# Altium schematic sheet Smart_Clock_Mainboard.SchDoc
size A2
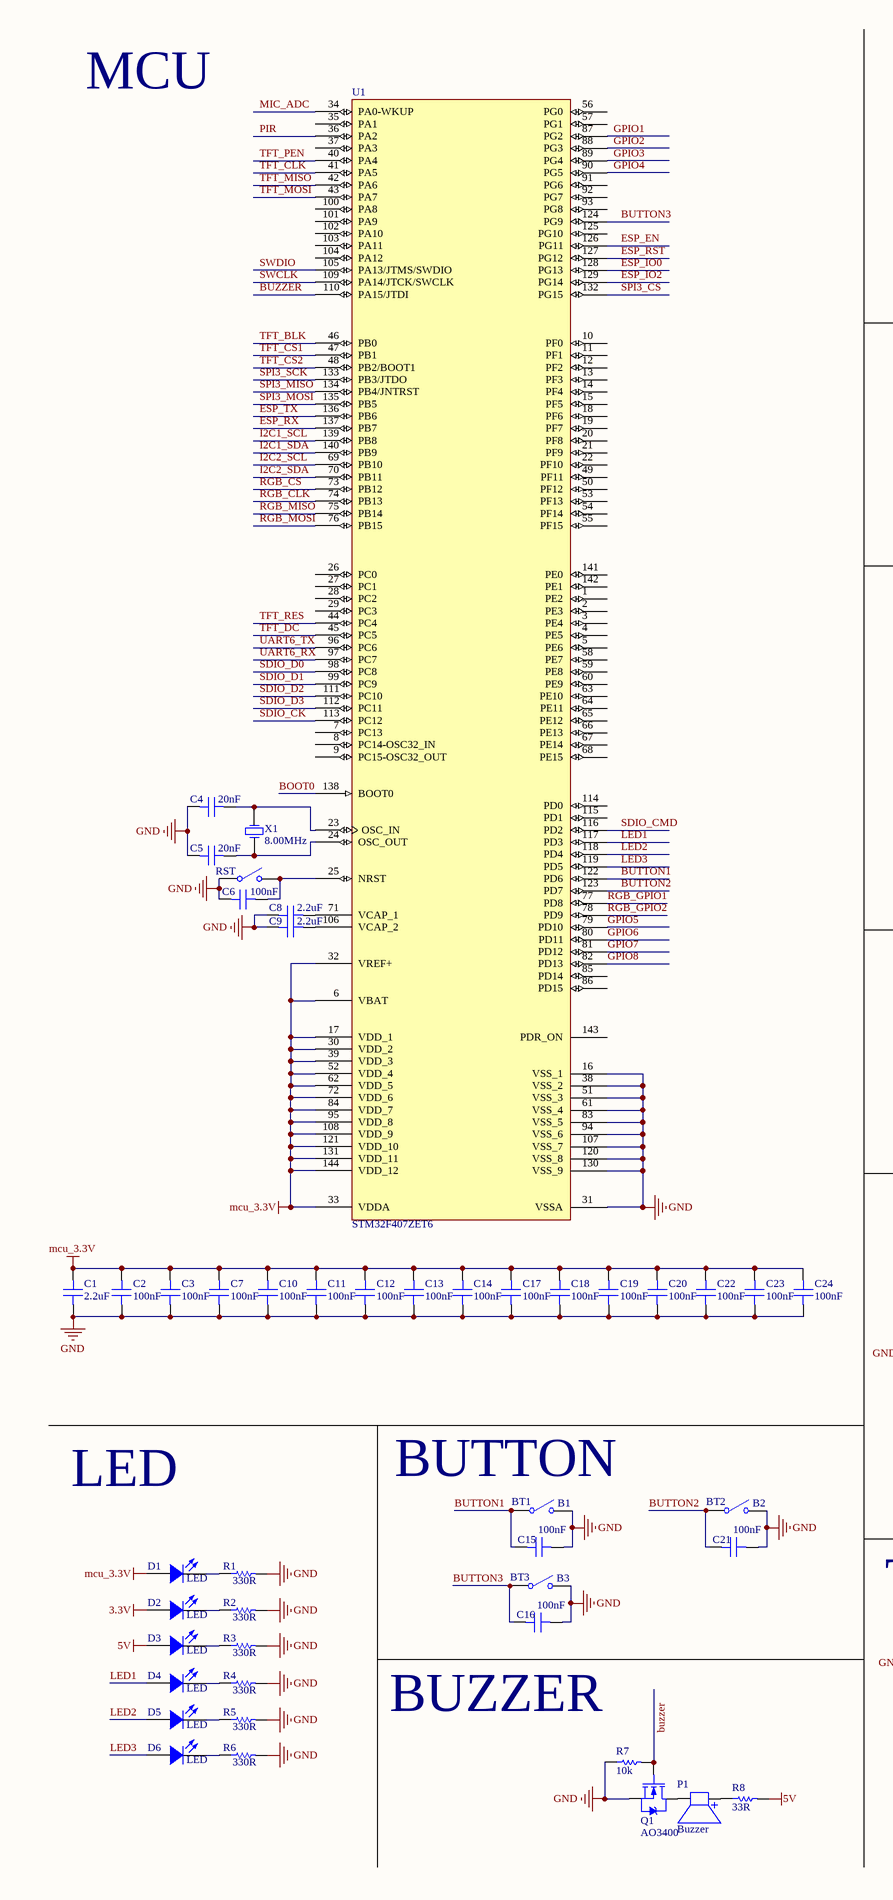
[diagram p0: Smart_Clock_Mainboard.SchDoc, left]
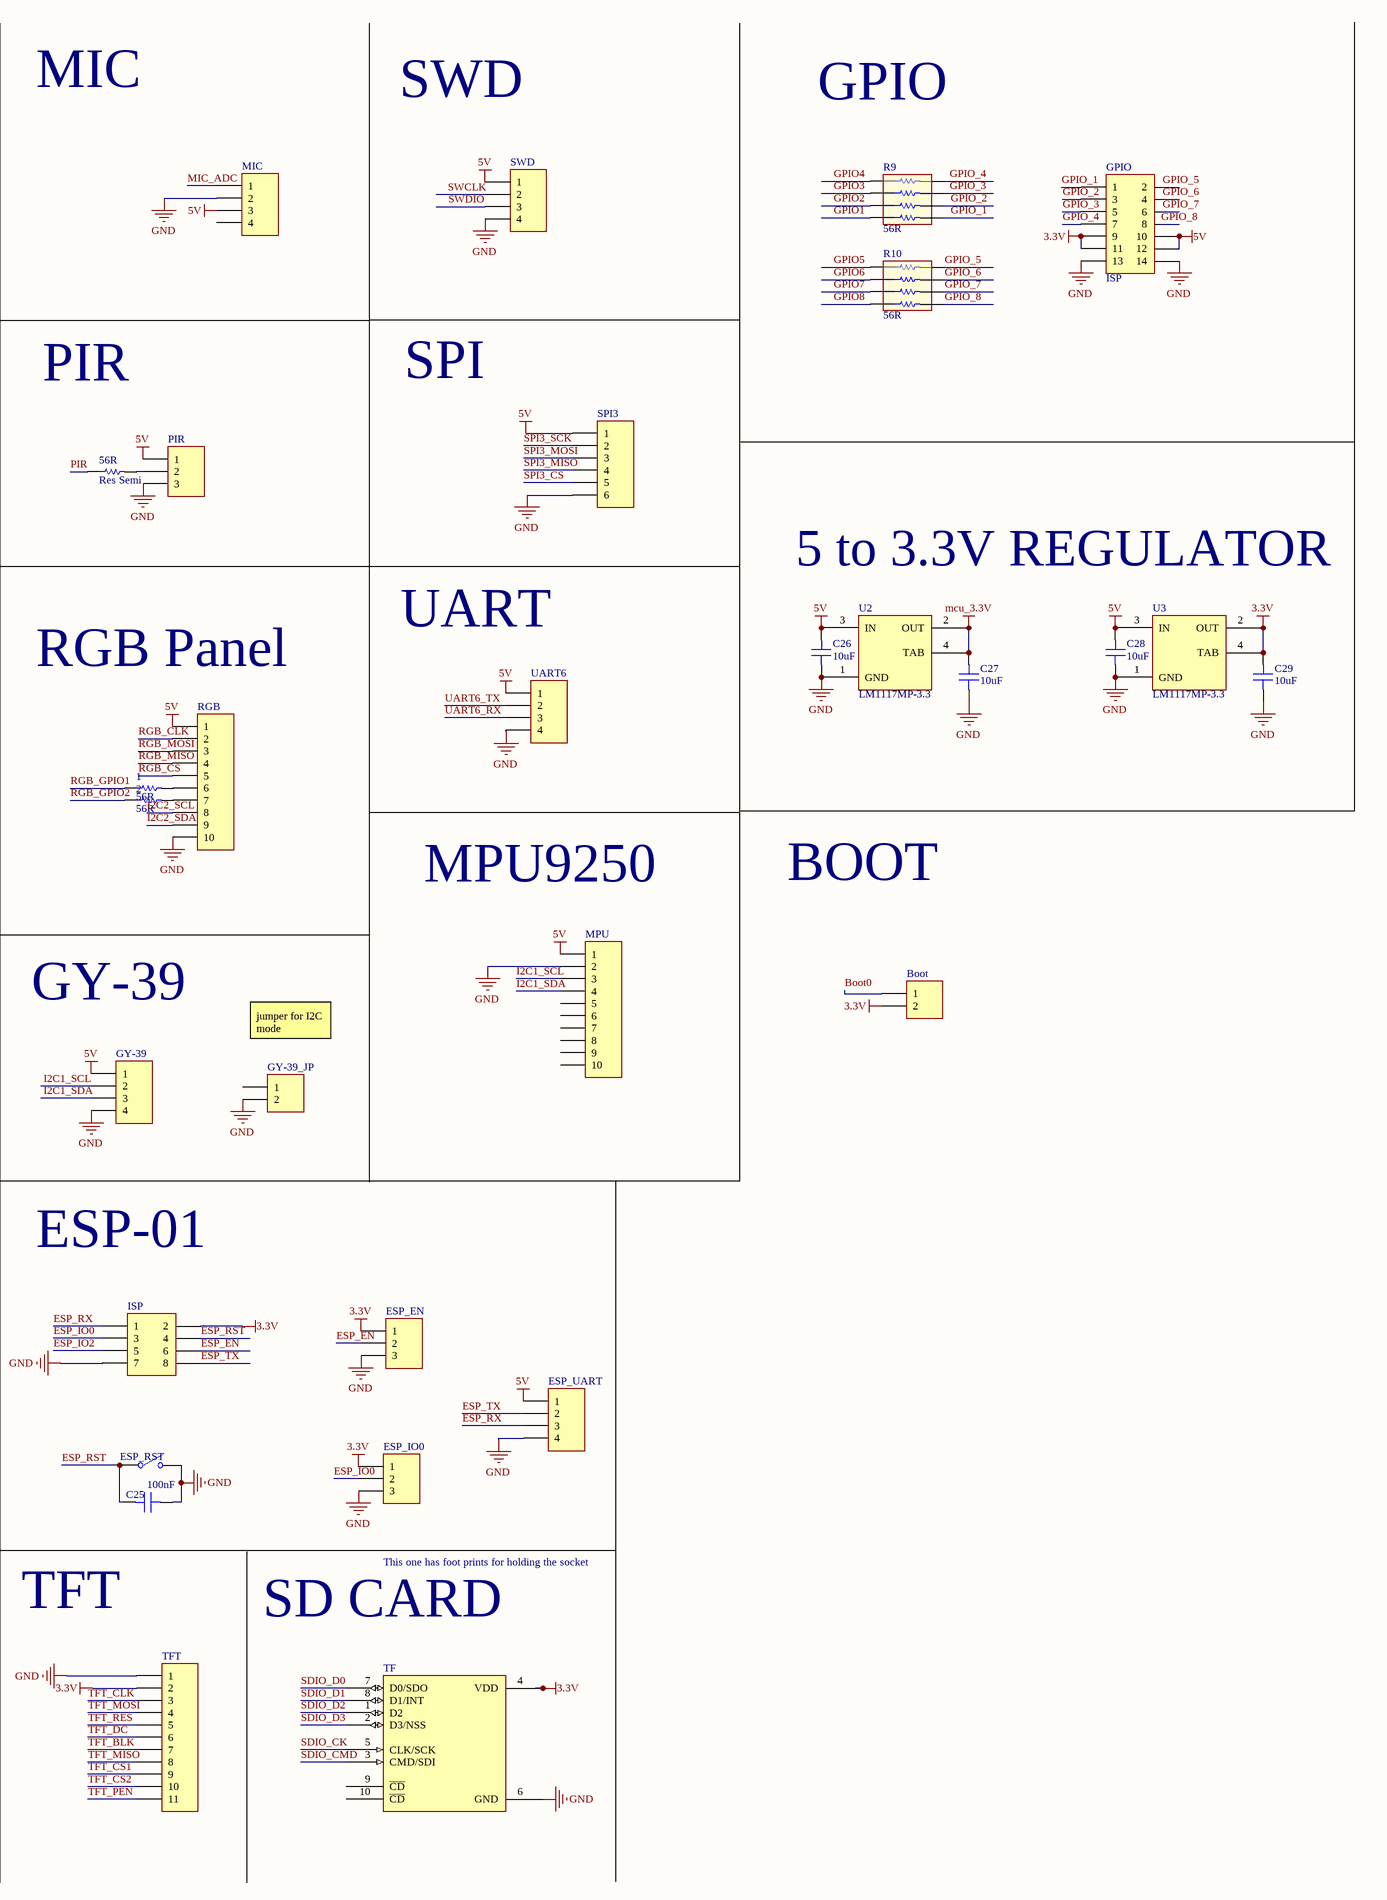
[diagram p1: Smart_Clock_Mainboard.SchDoc, right]

## Parts
1  56R  [CR2012-0805]
2  56R  [CR2012-0805]
56R  Res Semi  [CR2012-0805]
Boot  Boot  [HDR1X2]  (value not drawn)
BT1  B1  [PUSH SWITCH 2-PIN]
BT2  B2  [PUSH SWITCH 2-PIN]
BT3  B3  [PUSH SWITCH 2-PIN]
C1  2.2uF  [CC2012-0805]
C2  100nF  [CC2012-0805]
C3  100nF  [CC2012-0805]
C4  20nF  [CC2012-0805]
C5  20nF  [CC2012-0805]
C6  100nF  [CC2012-0805]
C7  100nF  [CC2012-0805]
C8  2.2uF  [CC2012-0805]
C9  2.2uF  [CC2012-0805]
C10  100nF  [CC2012-0805]
C11  100nF  [CC2012-0805]
C12  100nF  [CC2012-0805]
C13  100nF  [CC2012-0805]
C14  100nF  [CC2012-0805]
C15  100nF  [CC2012-0805]
C16  100nF  [CC2012-0805]
C17  100nF  [CC2012-0805]
C18  100nF  [CC2012-0805]
C19  100nF  [CC2012-0805]
C20  100nF  [CC2012-0805]
C21  100nF  [CC2012-0805]
C22  100nF  [CC2012-0805]
C23  100nF  [CC2012-0805]
C24  100nF  [CC2012-0805]
C25  100nF  [CC2012-0805]
C26  10uF  [CC2012-0805]
C27  10uF  [CC2012-0805]
C28  10uF  [CC2012-0805]
C29  10uF  [CC2012-0805]
D1  LED  [D0805]
D2  LED  [D0805]
D3  LED  [D0805]
D4  LED  [D0805]
D5  LED  [D0805]
D6  LED  [D0805]
ESP_EN  ESP_EN  [HDR1X3]  (value not drawn)
ESP_IO0  ESP_IO0  [HDR1X3]  (value not drawn)
ESP_RST  ESP_RST  [PUSH SWITCH 2-PIN]  (value not drawn)
ESP_UART  ESP_UART  [LOCKEDHDR-4W]  (value not drawn)
GPIO  ISP  [HDR2X7]
GY-39  CONN0M  [HDR1X4]  (value not drawn)
GY-39_JP  MOTOR  [HDR1X2]  (value not drawn)
ISP  ISP  [HDR1.27_2x4]  (value not drawn)
MIC  Header 4  [HDR1X4]  (value not drawn)
MPU  Header10  [HDR1X10]  (value not drawn)
P1  Buzzer  [BUZ-9.0]
PIR  PIR  [HDR1X3]  (value not drawn)
Q1  AO3400  [SO-G3/Z3.3]
R1  330R  [CR2012-0805]
R2  330R  [CR2012-0805]
R3  330R  [CR2012-0805]
R4  330R  [CR2012-0805]
R5  330R  [CR2012-0805]
R6  330R  [CR2012-0805]
R7  10k  [CR2012-0805]
R8  33R  [CR2012-0805]
R9  56R  [ARC241-0603x4]
R10  56R  [ARC241-0603x4]
RGB  Header 10  [HDR1X10]  (value not drawn)
RST  RESET  [PUSH SWITCH 2-PIN]  (value not drawn)
SPI3  SPI3  [HDR1X6]  (value not drawn)
SWD  Header 4  [LOCKEDHDR-4W]  (value not drawn)
TF  TF CD Socket  [SD-502774-0811]  (value not drawn)
TFT  TFT  [HDR1X11]  (value not drawn)
U1  STM32F407ZET6  [LQFP144_M]
U2  LM1117MP-3.3  [MP04A_N]
U3  LM1117MP-3.3  [MP04A_N]
UART6  UART6  [LOCKEDHDR-4W]  (value not drawn)
X1  8.00MHz  [BCY-W2/E4.7]

## Nets
3.3V: Boot.2 C29.2 D2.1(A) ESP_EN.1 ESP_IO0.1 GPIO.9 GPIO.11 ISP.2 TF.4(VDD) TFT.2 U3.2(OUT) U3.4(TAB)
5V: C26.2 C28.2 D3.1(A) ESP_UART.1 GPIO.10 GPIO.12 GY-39.1 MIC.3 MPU.1 PIR.1 R8.2 RGB.1 SPI3.1 SWD.1 U2.3(IN) U3.3(IN) UART6.1
GND: BT1.2(NO) BT2.2(NO) BT3.2(NO) C1.1 C2.1 C3.1 C4.1 C5.1 C6.1 C7.1 C8.1 C9.1 C10.1 C11.1 C12.1 C13.1 C14.1 C15.2 C16.2 C17.1 C18.1 C19.1 C20.1 C21.2 C22.1 C23.1 C24.1 C25.2 C26.1 C27.1 C28.1 C29.1 ESP_EN.3 ESP_IO0.3 ESP_RST.2(NO) ESP_UART.4 GPIO.13 GPIO.14 GY-39.4 GY-39_JP.2 ISP.7 MIC.2 MPU.2 PIR.3 Q1.2(S) R1.2 R2.2 R3.2 R4.2 R5.2 R6.2 R7.1 RGB.10 RST.1(COMMON) SPI3.6 SWD.4 TF.6(GND) TFT.1 U1.16(VSS_1) U1.31(VSSA) U1.38(VSS_2) U1.51(VSS_3) U1.61(VSS_4) U1.83(VSS_5) U1.94(VSS_6) U1.107(VSS_7) U1.120(VSS_8) U1.130(VSS_9) U2.1(GND) U3.1(GND) UART6.4
mcu_3.3V: C1.2 C2.2 C3.2 C7.2 C10.2 C11.2 C12.2 C13.2 C14.2 C17.2 C18.2 C19.2 C20.2 C22.2 C23.2 C24.2 C27.2 D1.1(A) U1.6(VBAT) U1.17(VDD_1) U1.30(VDD_2) U1.32(VREF+) U1.33(VDDA) U1.39(VDD_3) U1.52(VDD_4) U1.62(VDD_5) U1.72(VDD_6) U1.84(VDD_7) U1.95(VDD_8) U1.108(VDD_9) U1.121(VDD_10) U1.131(VDD_11) U1.144(VDD_12) U2.2(OUT) U2.4(TAB)
BOOT0: Boot.1 U1.138(BOOT0)
BUTTON1: BT1.1(COMMON) C15.1 U1.122(PD6)
BUTTON2: BT2.1(COMMON) C21.1 U1.123(PD7)
BUTTON3: BT3.1(COMMON) C16.1 U1.124(PG9)
BUZZER: Q1.1(G) R7.2 U1.110(PA15/JTDI)
ESP_EN: ESP_EN.2 ISP.6 U1.126(PG11)
ESP_IO0: ESP_IO0.2 ISP.3 U1.128(PG13)
ESP_IO2: ISP.5 U1.129(PG14)
ESP_RST: C25.1 ESP_RST.1(COMMON) ISP.4 U1.127(PG12)
ESP_RX: ESP_UART.3 ISP.1 U1.137(PB7)
ESP_TX: ESP_UART.2 ISP.8 U1.136(PB6)
GPIO1: R9.7 U1.87(PG2)
GPIO2: R9.5 U1.88(PG3)
GPIO3: R9.3 U1.89(PG4)
GPIO4: R9.1 U1.90(PG5)
GPIO5: R10.1 U1.79(PD10)
GPIO6: R10.3 U1.80(PD11)
GPIO7: R10.5 U1.81(PD12)
GPIO8: R10.7 U1.82(PD13)
GPIO_1: GPIO.1 R9.8
GPIO_2: GPIO.3 R9.6
GPIO_3: GPIO.5 R9.4
GPIO_4: GPIO.7 R9.2
GPIO_5: GPIO.2 R10.2
GPIO_6: GPIO.4 R10.4
GPIO_7: GPIO.6 R10.6
GPIO_8: GPIO.8 R10.8
I2C1_SCL: GY-39.2 MPU.3 U1.139(PB8)
I2C1_SDA: GY-39.3 MPU.4 U1.140(PB9)
I2C2_SCL: RGB.8 U1.69(PB10)
I2C2_SDA: RGB.9 U1.70(PB11)
LED1: D4.1(A) U1.117(PD3)
LED2: D5.1(A) U1.118(PD4)
LED3: D6.1(A) U1.119(PD5)
MIC_ADC: MIC.1 U1.34(PA0-WKUP)
PIR: 56R.1 U1.36(PA2)
RGB_CLK: RGB.2 U1.74(PB13)
RGB_CS: RGB.5 U1.73(PB12)
RGB_GPIO1: 1.1 U1.77(PD8)
RGB_GPIO2: 2.1 U1.78(PD9)
RGB_MISO: RGB.4 U1.75(PB14)
RGB_MOSI: RGB.3 U1.76(PB15)
SDIO_CK: TF.5(CLK/SCK) U1.113(PC12)
SDIO_CMD: TF.3(CMD/SDI) U1.116(PD2)
SDIO_D0: TF.7(D0/SDO) U1.98(PC8)
SDIO_D1: TF.8(D1/INT) U1.99(PC9)
SDIO_D2: TF.1(D2) U1.111(PC10)
SDIO_D3: TF.2(D3/NSS) U1.112(PC11)
SPI3_CS: SPI3.5 U1.132(PG15)
SPI3_MISO: SPI3.4 U1.134(PB4/JNTRST)
SPI3_MOSI: SPI3.3 U1.135(PB5)
SPI3_SCK: SPI3.2 U1.133(PB3/JTDO)
SWCLK: SWD.2 U1.109(PA14/JTCK/SWCLK)
SWDIO: SWD.3 U1.105(PA13/JTMS/SWDIO)
TFT_BLK: TFT.7 U1.46(PB0)
TFT_CLK: TFT.3 U1.41(PA5)
TFT_CS1: TFT.9 U1.47(PB1)
TFT_CS2: TFT.10 U1.48(PB2/BOOT1)
TFT_DC: TFT.6 U1.45(PC5)
TFT_MISO: TFT.8 U1.42(PA6)
TFT_MOSI: TFT.4 U1.43(PA7)
TFT_PEN: TFT.11 U1.40(PA4)
TFT_RES: TFT.5 U1.44(PC4)
UART6_RX: U1.97(PC7) UART6.3
UART6_TX: U1.96(PC6) UART6.2
Net1_2: 1.2 RGB.6
Net2_2: 2.2 RGB.7
Net56R_2: 56R.2 PIR.2
NetC4_2: C4.2 U1.23(OSC_IN) X1.2(OSC2)
NetC5_2: C5.2 U1.24(OSC_OUT) X1.1(OSC1)
NetC6_2: C6.2 RST.2(NO) U1.25(NRST)
NetC8_2: C8.2 U1.71(VCAP_1)
NetC9_2: C9.2 U1.106(VCAP_2)
NetD1_2: D1.2(K) R1.1
NetD2_2: D2.2(K) R2.1
NetD3_2: D3.2(K) R3.1
NetD4_2: D4.2(K) R4.1
NetD5_2: D5.2(K) R5.1
NetD6_2: D6.2(K) R6.1
NetP1_1: P1.1 R8.1
NetP1_2: P1.2 Q1.3(D)

Not connected (* = marked no-connect by the designer): GY-39_JP 1; MIC 4; MPU 5 6 7 8 9 10; TF 9(~{CD}) 10(~{CD}); U1 1(PE2) 2(PE3) 3(PE4) 4(PE5) 5(PE6) 7(PC13) 8(PC14-OSC32_IN) 9(PC15-OSC32_OUT) 10(PF0) 11(PF1) 12(PF2) 13(PF3) 14(PF4) 15(PF5) 18(PF6) 19(PF7) 20(PF8) 21(PF9) 22(PF10) 26(PC0) 27(PC1) 28(PC2) 29(PC3) 35(PA1) 37(PA3) 49(PF11) 50(PF12) 53(PF13) 54(PF14) 55(PF15) 56(PG0) 57(PG1) 58(PE7) 59(PE8) 60(PE9) 63(PE10) 64(PE11) 65(PE12) 66(PE13) 67(PE14) 68(PE15) 85(PD14) 86(PD15) 91(PG6) 92(PG7) 93(PG8) 100(PA8) 101(PA9) 102(PA10) 103(PA11) 104(PA12) 114(PD0) 115(PD1) 125(PG10) 141(PE0) 142(PE1) 143(PDR_ON)

## Notes on the sheet
- MCU
- MIC
- SWD
- GPIO
- PIR
- SPI
- 5 to 3.3V REGULATOR
- UART
- (near RGB) RGB Panel
- MPU9250
- BOOT
- GY-39
- jumper for I2C mode
- ESP-01
- LED
- (near BT1) BUTTON
- This one has foot prints for holding the socket
- TFT
- SD CARD
- (near C16) BUZZER

## Library data of the parts
1 2 56R R1-R8 = Res Semi: Semiconductor Resistor; Published: 8-Jun-2000; LatestRevisionDate: 17-Jul-2002; LatestRevisionNote: Re-released for DXP Platform.; Publisher: Altium Limited
Boot GY-39_JP = Header 2: Header, 2-Pin; Revision: 17-Jul-2002: Re-released for DXP Platform.; Publisher: Altium Limited
BT1-BT3 ESP_RST RST = SW-SPST: Single-Pole, Single-Throw Switch; Published: 24-Mar-1999; Revision: July-2002: Re-released for DXP Platform.; Publisher: Altium Limited
C1-C29 = Cap Semi: Capacitor (Semiconductor SIM Model); Published: 8-Jun-2000; LatestRevisionDate: 17-Jul-2002; LatestRevisionNote: Re-released for DXP Platform.; PackageReference: C1206; Publisher: Altium Limited
D1-D6 = LED: Typical RED GaAs LED; Published: 8-Jun-2000; LatestRevisionDate: 08-Jul-2005; LatestRevisionNote: Mech Layer 1 removed.; PackageReference: LED-1; Publisher: Altium Limited
ESP_EN ESP_IO0 PIR = Header 3: Header, 3-Pin; Revision: 17-Jul-2002: Re-released for DXP Platform.; Publisher: Altium Limited
ESP_UART GY-39 MIC SWD UART6 = Header 4: Header, 4-Pin; Revision: 17-Jul-2002: Re-released for DXP Platform.; Publisher: Altium Limited
GPIO = Header 7X2: Header, 7-Pin, Dual row; Publisher: Altium Limited; Revision: 17-Jul-2002: Re-released for DXP Platform.
ISP = Header 4X2: Header, 5-Pin, Dual row; Revision: 17-Jul-2002: Re-released for DXP Platform.; Publisher: Altium Limited
MPU RGB = Header 10: Header, 10-Pin; LatestRevisionDate: 17-Jul-2002; LatestRevisionNote: Re-released for DXP Platform.; Publisher: Altium Limited
Q1 = AO3400: N-Channel MOSFET; Published: 8-Jun-2000; Revision: July-2002: Re-released for DXP Platform.; Publisher: Altium Limited
R9 R10 = Res Array: 4x Resistor Array; Published: 8-Jun-2000; LatestRevisionDate: 17-Jul-2002; LatestRevisionNote: Re-released for DXP Platform.; Publisher: Altium Limited
SPI3 = Header 6: Header, 6-Pin; LatestRevisionDate: 17-Jul-2002; LatestRevisionNote: Re-released for DXP Platform.; Publisher: Altium Limited
TF = TF CD Socket: TF Card Socket with Spring with Card Detection
TFT = Header 11: Header, 11-Pin; LatestRevisionDate: 17-Jul-2002; LatestRevisionNote: Re-released for DXP Platform.; Publisher: Altium Limited
U1 = STM32F407ZET6: STM32 ARM-based 32-bit MCU with 64 Kbytes Flash, 144-pin LQFP, Industrial Temperature; Published: 30-May-2008; DatasheetVersion: rev6, Mar-2008; PackageVersion: Mar-2008; PackageReference: LQFP100; Publisher: Altium Limited; PackageDescription: 100-Pin Low-Profile Quad Flat Pack, 14 x 14 mm Body, 0.5 mm Pitch (LQFP100); ComponentLink1Description: Manufacturer Link; ComponentLink1URL: www.st.com/stm32; ComponentLink2Description: Datasheet; ComponentLink2URL: http://www.st.com/stonline/products/literature/ds/13587.pdf
U2 U3 = LM1117MP-3.3: 800mA Low-Dropout Linear Regulator; Manufacturer: National Semiconductor; CompType: LDO IC; PackageTopMarking: XYTT*N05A; Published: 27-Nov-2008; DatasheetVersion: Apr-2006; PackageVersion: revB, Apr-2003; PackageReference: MP04A; Publisher: Altium Limited; PackageDescription: Molded SOT-223, 6.50 x 3.56 x 1.6mm Body, 4 Lead, 2.3mm Pitch; PartNumber: LM1117MP-3.3; RoHS: O; PinCount: 4; DigiKeyPartNumber: LM1117MP-3.3CT-ND; Code_JEDEC: TO-261-AA; Code_IPC: SOT223-4; ComponentLink1Description: LM1117 Datasheet; ComponentLink1URL: http://www.national.com/ds/LM/LM1117.pdf; ComponentLink2Description: LM1117 Web Page; ComponentLink2URL: http://www.national.com/pf/LM/LM1117.html; ComponentLink3Description: MP04A Package Page; ComponentLink3URL: http://www.national.com/packaging/folders/mp04a.html
X1 = XTAL: Crystal Oscillator; Published: 8-Jun-2000; Revision: July-2002: Re-released for DXP Platform.; Publisher: Altium Limited